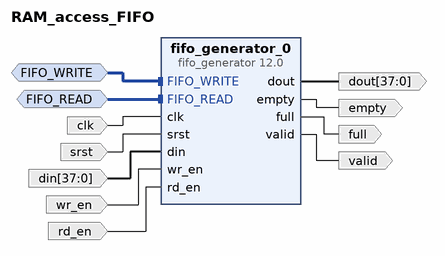
[diagram p0: block diagram of the top level]
# Vivado block design RAM_access_FIFO, Vivado 2015.2
create_bd_design RAM_access_FIFO

create_bd_intf_port -mode Slave -vlnv xilinx.com:interface:fifo_write_rtl:1.0 FIFO_WRITE
create_bd_intf_port -mode Slave -vlnv xilinx.com:interface:fifo_read_rtl:1.0 FIFO_READ
create_bd_port -dir I -type clk clk
create_bd_port -dir I srst
create_bd_port -dir I -from 37 -to 0 din
create_bd_port -dir I wr_en
create_bd_port -dir I rd_en
create_bd_port -dir O -from 37 -to 0 dout
create_bd_port -dir O empty
create_bd_port -dir O full
create_bd_port -dir O valid

create_bd_cell -type ip -vlnv xilinx.com:ip:fifo_generator:12.0 fifo_generator_0
set_property -dict [list \
  CONFIG.Input_Data_Width 38 \
  CONFIG.Input_Depth 512 \
  CONFIG.Reset_Type Synchronous_Reset \
  CONFIG.Almost_Full_Flag false \
  CONFIG.Valid_Flag true \
] [get_bd_cells fifo_generator_0]

# ---- connections ----

connect_bd_intf_net [get_bd_intf_ports FIFO_WRITE] [get_bd_intf_pins fifo_generator_0/FIFO_WRITE]
connect_bd_intf_net [get_bd_intf_ports FIFO_READ] [get_bd_intf_pins fifo_generator_0/FIFO_READ]
connect_bd_net [get_bd_ports clk] [get_bd_pins fifo_generator_0/clk]
connect_bd_net [get_bd_ports srst] [get_bd_pins fifo_generator_0/srst]
connect_bd_net [get_bd_ports din] [get_bd_pins fifo_generator_0/din]
connect_bd_net [get_bd_ports wr_en] [get_bd_pins fifo_generator_0/wr_en]
connect_bd_net [get_bd_ports rd_en] [get_bd_pins fifo_generator_0/rd_en]
connect_bd_net [get_bd_pins fifo_generator_0/dout] [get_bd_ports dout]
connect_bd_net [get_bd_pins fifo_generator_0/empty] [get_bd_ports empty]
connect_bd_net [get_bd_pins fifo_generator_0/full] [get_bd_ports full]
connect_bd_net [get_bd_pins fifo_generator_0/valid] [get_bd_ports valid]

validate_bd_design
save_bd_design
